# EAGLE design prototype card (EAGLE 9.6.2)
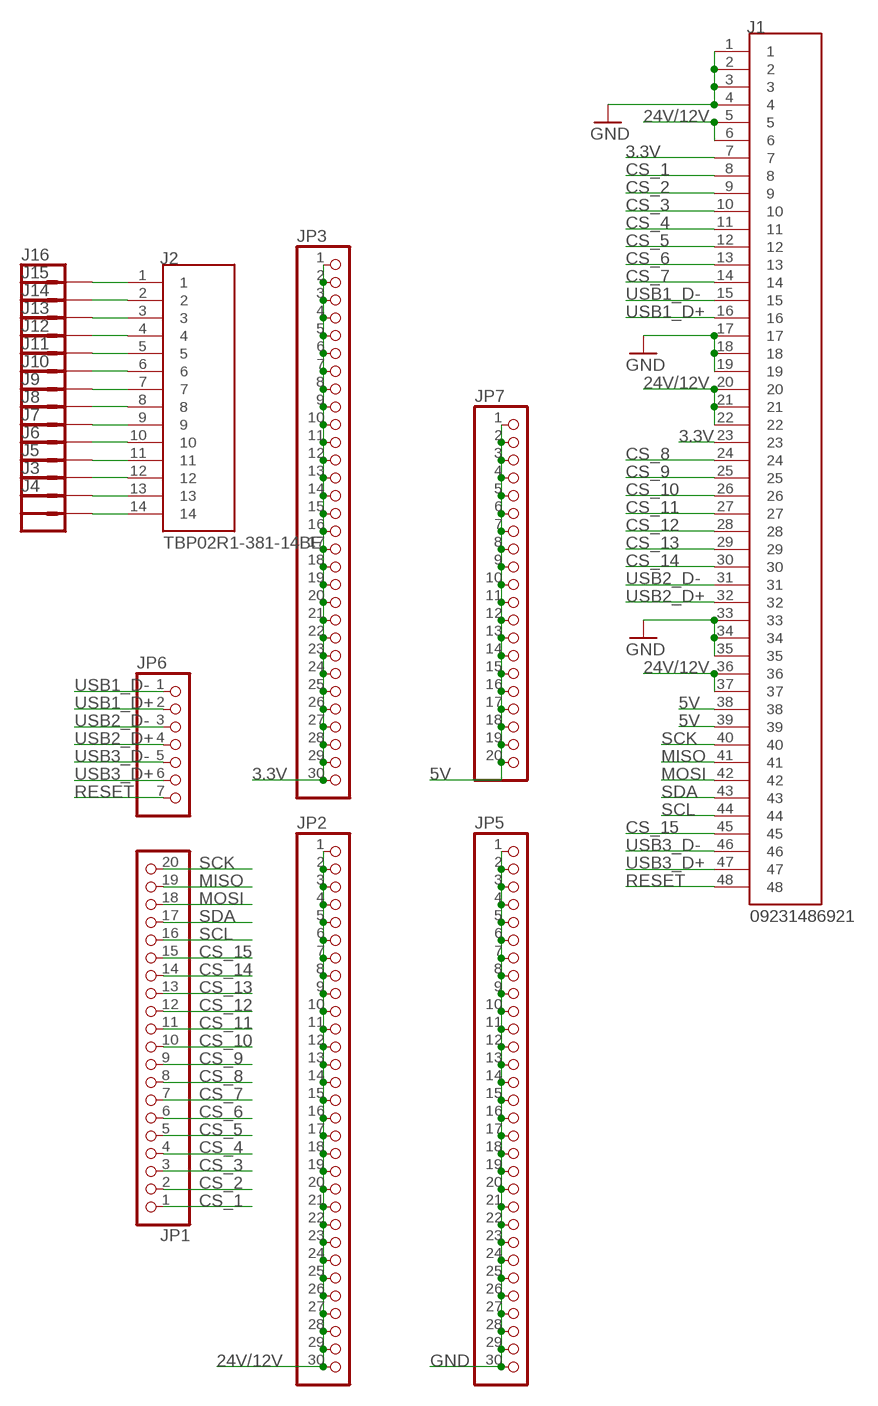
[diagram p0: schematic, sheet 1]

## Parts
J1  09231486921  [HARTING_09231486921]
J2  TBP02R1-381-14BE  [CUI_TBP02R1-381-14BE]
J3  CONN_01PTH_LONGPAD  [1X01_LONGPAD]
J4  CONN_01PTH_LONGPAD  [1X01_LONGPAD]
J5  CONN_01PTH_LONGPAD  [1X01_LONGPAD]
J6  CONN_01PTH_LONGPAD  [1X01_LONGPAD]
J7  CONN_01PTH_LONGPAD  [1X01_LONGPAD]
J8  CONN_01PTH_LONGPAD  [1X01_LONGPAD]
J9  CONN_01PTH_LONGPAD  [1X01_LONGPAD]
J10  CONN_01PTH_LONGPAD  [1X01_LONGPAD]
J11  CONN_01PTH_LONGPAD  [1X01_LONGPAD]
J12  CONN_01PTH_LONGPAD  [1X01_LONGPAD]
J13  CONN_01PTH_LONGPAD  [1X01_LONGPAD]
J14  CONN_01PTH_LONGPAD  [1X01_LONGPAD]
J15  CONN_01PTH_LONGPAD  [1X01_LONGPAD]
J16  CONN_01PTH_LONGPAD  [1X01_LONGPAD]
JP1  PINHD-1X20  [1X20]
JP2  PINHD-1X30  [1X30]
JP3  PINHD-1X30  [1X30]
JP5  PINHD-1X30  [1X30]
JP6  PINHD-1X7  [1X07]
JP7  PINHD-1X20  [1X20]

## Nets
3.3V: J1.7 J1.23 JP3.1 JP3.2 JP3.3 JP3.4 JP3.5 JP3.6 JP3.7 JP3.8 JP3.9 JP3.10 JP3.11 JP3.12 JP3.13 JP3.14 JP3.15 JP3.16 JP3.17 JP3.18 JP3.19 JP3.20 JP3.21 JP3.22 JP3.23 JP3.24 JP3.25 JP3.26 JP3.27 JP3.28 JP3.29 JP3.30
5V: J1.38 J1.39 JP7.1 JP7.2 JP7.3 JP7.4 JP7.5 JP7.6 JP7.7 JP7.8 JP7.9 JP7.10 JP7.11 JP7.12 JP7.13 JP7.14 JP7.15 JP7.16 JP7.17 JP7.18 JP7.19 JP7.20
24V/12V: J1.5 J1.6 J1.20 J1.21 J1.22 J1.36 J1.37 JP2.1 JP2.2 JP2.3 JP2.4 JP2.5 JP2.6 JP2.7 JP2.8 JP2.9 JP2.10 JP2.11 JP2.12 JP2.13 JP2.14 JP2.15 JP2.16 JP2.17 JP2.18 JP2.19 JP2.20 JP2.21 JP2.22 JP2.23 JP2.24 JP2.25 JP2.26 JP2.27 JP2.28 JP2.29 JP2.30
CS_1: J1.8 JP1.1
CS_2: J1.9 JP1.2
CS_3: J1.10 JP1.3
CS_4: J1.11 JP1.4
CS_5: J1.12 JP1.5
CS_6: J1.13 JP1.6
CS_7: J1.14 JP1.7
CS_8: J1.24 JP1.8
CS_9: J1.25 JP1.9
CS_10: J1.26 JP1.10
CS_11: J1.27 JP1.11
CS_12: J1.28 JP1.12
CS_13: J1.29 JP1.13
CS_14: J1.30 JP1.14
CS_15: J1.45 JP1.15
GND: J1.1 J1.2 J1.3 J1.4 J1.17 J1.18 J1.19 J1.33 J1.34 J1.35 JP5.1 JP5.2 JP5.3 JP5.4 JP5.5 JP5.6 JP5.7 JP5.8 JP5.9 JP5.10 JP5.11 JP5.12 JP5.13 JP5.14 JP5.15 JP5.16 JP5.17 JP5.18 JP5.19 JP5.20 JP5.21 JP5.22 JP5.23 JP5.24 JP5.25 JP5.26 JP5.27 JP5.28 JP5.29 JP5.30
MISO: J1.41 JP1.19
MOSI: J1.42 JP1.18
N$1: J2.14 J4.1
N$2: J2.13 J3.1
N$4: J2.12 J5.1
N$5: J2.11 J6.1
N$6: J2.10 J7.1
N$7: J2.9 J8.1
N$8: J2.8 J9.1
N$9: J2.7 J10.1
N$10: J2.6 J11.1
N$11: J2.5 J12.1
N$12: J2.4 J13.1
N$13: J2.3 J14.1
N$14: J2.2 J15.1
N$15: J2.1 J16.1
RESET: J1.48 JP6.7
SCK: J1.40 JP1.20
SCL: J1.44 JP1.16
SDA: J1.43 JP1.17
USB1_D+: J1.16 JP6.2
USB1_D-: J1.15 JP6.1
USB2_D+: J1.32 JP6.4
USB2_D-: J1.31 JP6.3
USB3_D+: J1.47 JP6.6
USB3_D-: J1.46 JP6.5

## Library data of the parts
J1 = din41612_48_pin_board:09231486921: Check prices <https://pricing.snapeda.com/parts/8-1393644-0/TE%20Connectivity/view-part?ref=eda>; AVAILABILITY: In Stock; COMMENT: 09231486921; DESCRIPTION: Conn DIN 41612 M 48 POS 2.54mm Solder RA Thru-Hole Tray; EU_ROHS_COMPLIANCE: Compliant; MF: HARTING; MP: 09231486921; PACKAGE: None; PRICE: 6$; PURCHASE-URL-DIGIKEY: https://www.digikey.ca/en/products/detail/harting/09231486921/3180439
J2 = TBP02R1-381-14BE:TBP02R1-381-14BE: Check prices <https://pricing.snapeda.com/parts/TBP02R1-381-14BE/CUI%20Devices/view-part?ref=eda>; AVAILABILITY: In Stock; CUI_PURCHASE_URL: https://www.cuidevices.com/product/interconnect/connectors/terminal-blocks/tbp02r1-381-series?utm_source=snapeda.com&utm_medium=referral&utm_campaign=snapedaBOM; DESCRIPTION: 2~24 Poles, Pluggable,Receptacle, Horizontal, 3.81 Pitch, Terminal Block Connector; MF: CUI Devices; MP: TBP02R1-381-14BE; PACKAGE: None; PRICE: None; PURCHASE-URL: https://pricing.snapeda.com/search/part/TBP02R1-381-14BE/?ref=eda
J3-J16 = SparkFun-Connectors:CONN_01: Single connection point. Often used as Generic Header-pin footprint for 0.1 inch spaced/style header connections On any of the 0.1 inch spaced packages, you can populate with these: Break Away Headers - Straight <https://www.sparkfun.com/products/116> (PRT-00116) Break Away Male Headers - Right Angle <https://www.sparkfun.com/products/553> (PRT-00553) Female Headers <https://www.sparkfun.com/products/115> (PRT-00115) Break Away Headers - Machine Pin <https://www.sparkfun.com/products/117> (PRT-00117) Break Away Female Headers - Swiss Machine Pin <https://www.sparkfun.com/products/743> (PRT-00743) This device is also useful as a general connection point to wire up your design to another part of your project. Our various solder wires solder well into these plated through hole pads. Hook-Up Wire - Assortment (Stranded, 22 AWG) <https://www.sparkfun.com/products/11375> (PRT-11375) Hook-Up Wire - Assortment (Solid Core, 22 AWG) <https://www.sparkfun.com/products/11367> (PRT-11367) View the entire wire category on our website here <https://www.sparkfun.com/categories/141> Special notes: SMTSO-256-ET is a "flush mount" nut for a 4-40 screw. We mostly use this on specialty testbeds; it is a nice way to connect hardware to your PCB at an adjustable hieght. Also note, the SNAP packages are for using a snappable style connector. We sell a baggie of snaps and they are also used on two LilyPad designs: Snap Assortment - 30 pack (male and female) <https://www.sparkfun.com/products/11347> (DEV-11347) LilyPad Arduino SimpleSnap <https://www.sparkfun.com/products/10941> (DEV-10941) LilyPad SimpleSnap Protoboard <https://www.sparkfun.com/products/10940> (DEV-10940)
JP1 JP7 = pinhead:PINHD-1X20: PIN HEADER
JP2 JP3 JP5 = pinhead:PINHD-1X30: PIN HEADER
JP6 = pinhead:PINHD-1X7: PIN HEADER

## Net classes
1 POWER: clearance 0.508 mm

## Board
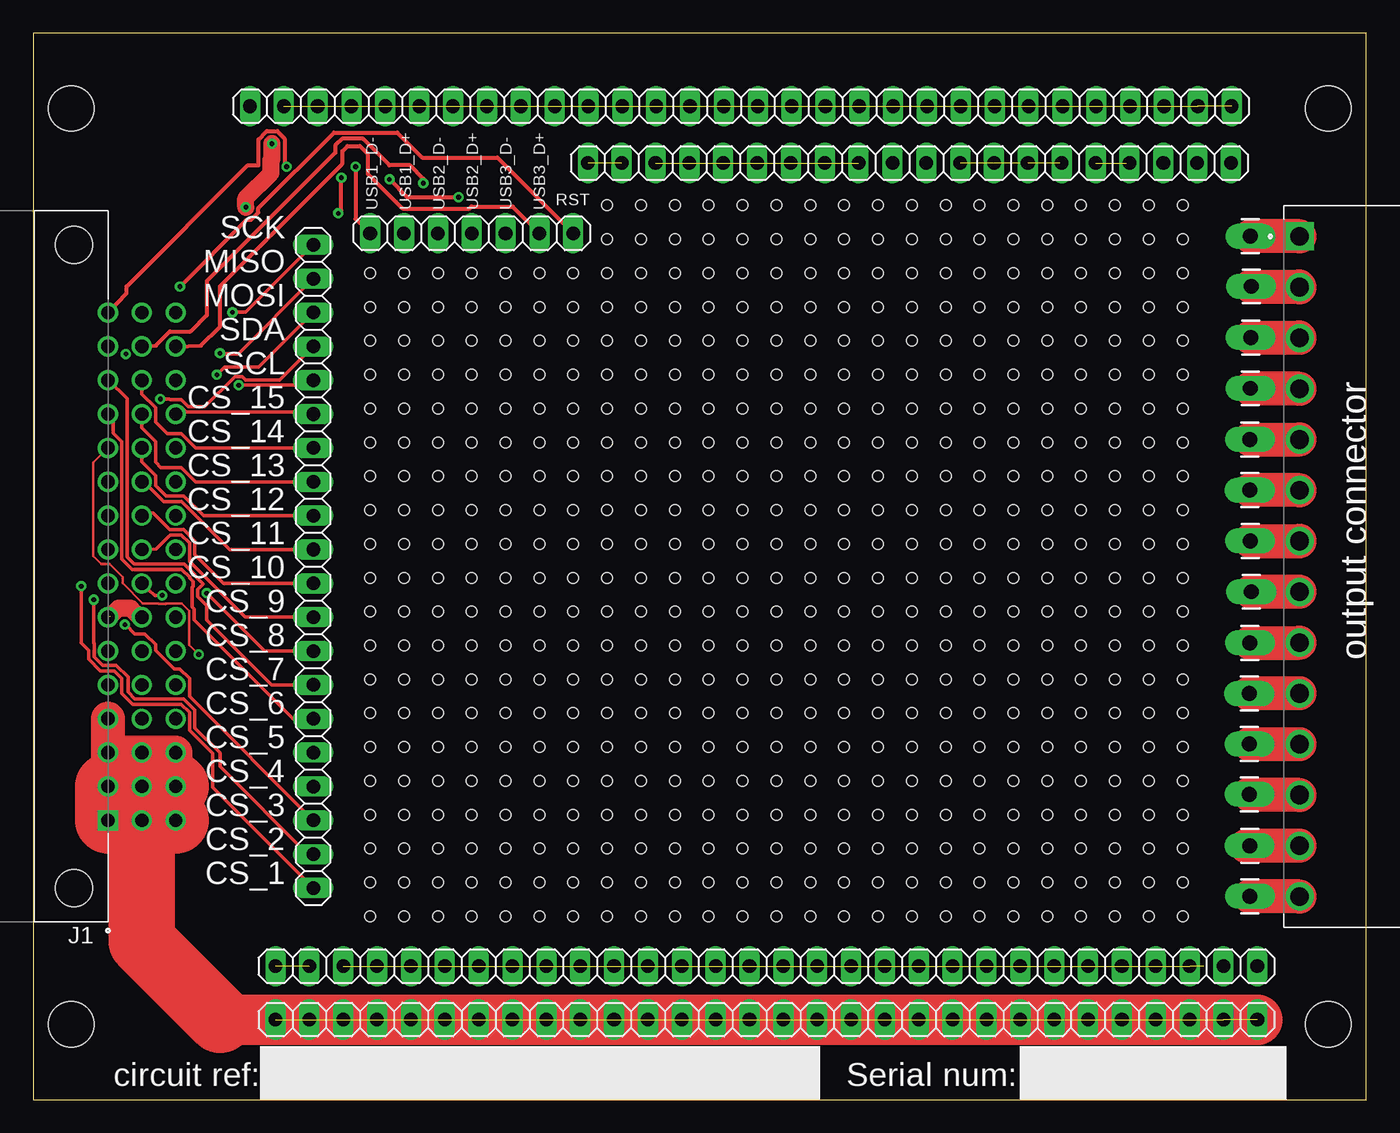
[diagram p1: board, top side]
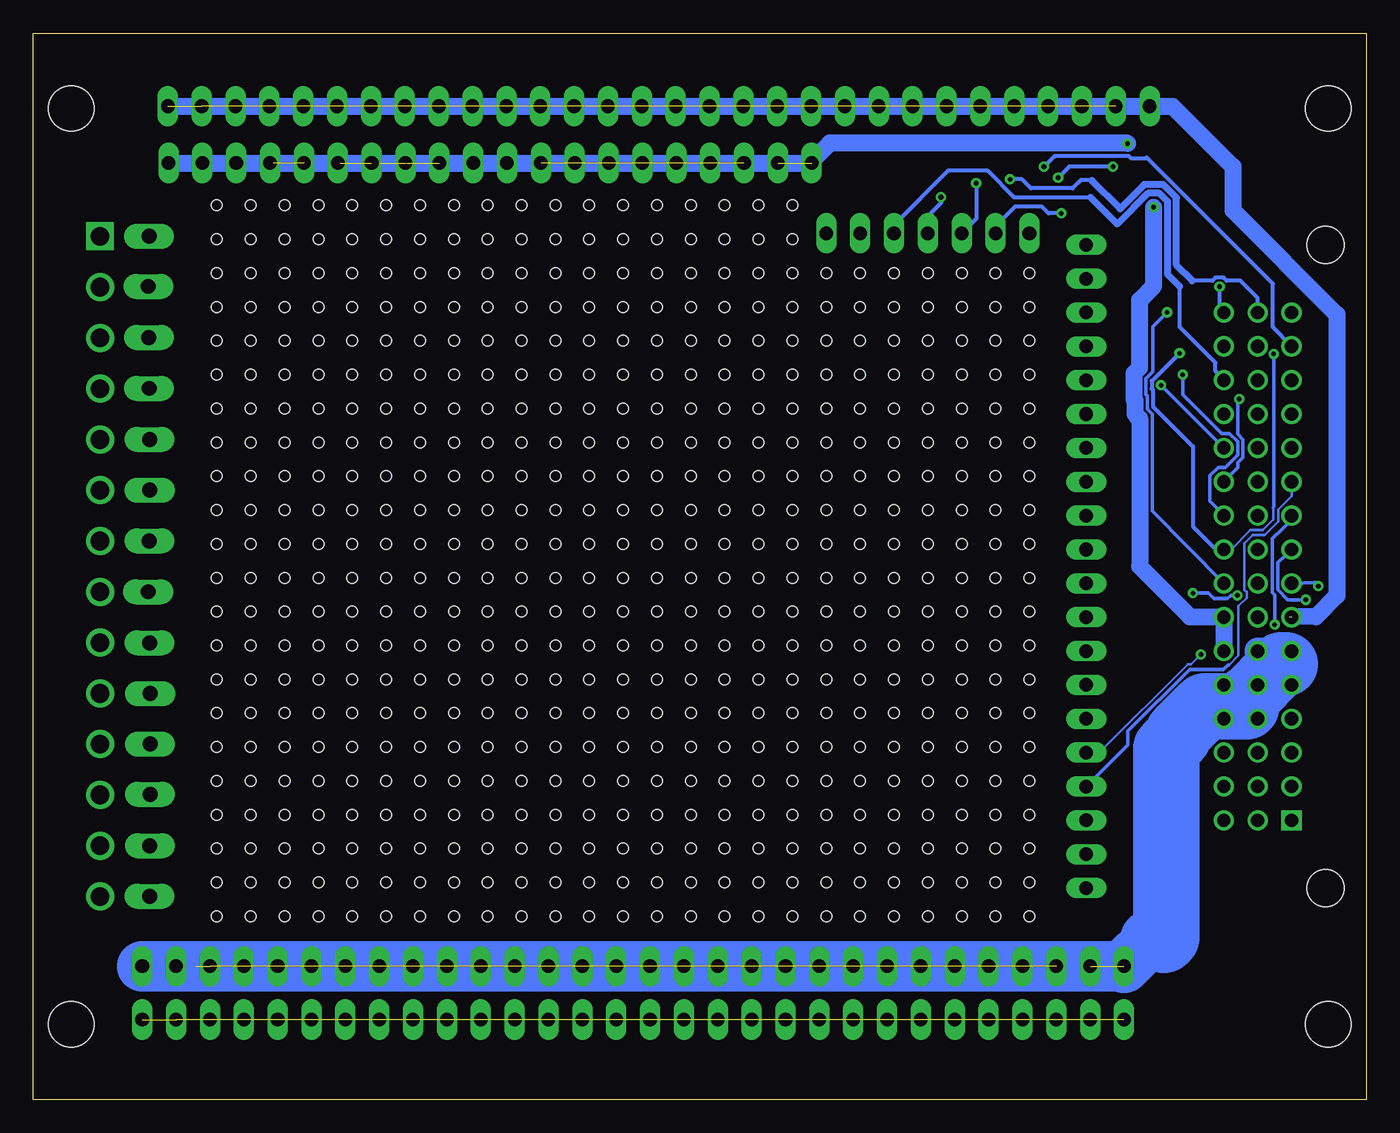
[diagram p2: board, bottom side, seen from below]

Size 100 x 80 mm. Coordinates in mm from the lower left corner, seen from the top.
Outline: 0,0 100,0 100,80 0,80 0,0
Copper layers (1*16): Top 0.035mm / dielectric 1.5mm / Bottom 0.035mm
Design rules "default": minimum track width 6mil, minimum drill 0.35mm, track to track 6mil, track to pad 6mil, pad to pad 6mil, via to via 6mil, smd to smd 6mil, copper to edge 40mil, drill to drill 6mil, minimum pad ring 10mil, minimum via ring 8mil, stop-mask expansion 4mil, vias tented up to drill 0mil, thermal gap 10mil
Holes 3.4 mm at 2.84,5.64 2.84,74.36 97.16,74.36 97.16,5.64
Holes 0.8 mm at 25.27,13.75 27.81,13.75 30.35,13.75 32.89,13.75 35.43,13.75 37.97,13.75 40.51,13.75 43.05,13.75 45.59,13.75 48.13,13.75 50.67,13.75 53.21,13.75 55.75,13.75 58.29,13.75 60.83,13.75 63.37,13.75 65.91,13.75 68.45,13.75 70.99,13.75 73.53,13.75 76.07,13.75 78.61,13.75 81.15,13.75 83.69,13.75 25.27,16.29 27.81,16.29 30.35,16.29 32.89,16.29 35.43,16.29 37.97,16.29 40.51,16.29 43.05,16.29 45.59,16.29 48.13,16.29 50.67,16.29 53.21,16.29 55.75,16.29 58.29,16.29 60.83,16.29 63.37,16.29 65.91,16.29 68.45,16.29 70.99,16.29 73.53,16.29 76.07,16.29 78.61,16.29 81.15,16.29 83.69,16.29 25.27,18.83 27.81,18.83 30.35,18.83 32.89,18.83 35.43,18.83 37.97,18.83 40.51,18.83 43.05,18.83 45.59,18.83 48.13,18.83 50.67,18.83 53.21,18.83 55.75,18.83 58.29,18.83 60.83,18.83 63.37,18.83 65.91,18.83 68.45,18.83 70.99,18.83 73.53,18.83 76.07,18.83 78.61,18.83 81.15,18.83 83.69,18.83 25.27,21.37 27.81,21.37 30.35,21.37 32.89,21.37 35.43,21.37 37.97,21.37 40.51,21.37 43.05,21.37 45.59,21.37 48.13,21.37 50.67,21.37 53.21,21.37 55.75,21.37 58.29,21.37 60.83,21.37 63.37,21.37 65.91,21.37 68.45,21.37 70.99,21.37 73.53,21.37 76.07,21.37 78.61,21.37 81.15,21.37 83.69,21.37 25.27,23.91 27.81,23.91 30.35,23.91 32.89,23.91 35.43,23.91 37.97,23.91 40.51,23.91 43.05,23.91 45.59,23.91 48.13,23.91 50.67,23.91 53.21,23.91 55.75,23.91 58.29,23.91 60.83,23.91 63.37,23.91 65.91,23.91 68.45,23.91 70.99,23.91 73.53,23.91 76.07,23.91 78.61,23.91 81.15,23.91 83.69,23.91 25.27,26.45 27.81,26.45 30.35,26.45 32.89,26.45 35.43,26.45 37.97,26.45 40.51,26.45 43.05,26.45 45.59,26.45 48.13,26.45 50.67,26.45 53.21,26.45 55.75,26.45 58.29,26.45 60.83,26.45 63.37,26.45 65.91,26.45 68.45,26.45 70.99,26.45 73.53,26.45 76.07,26.45 78.61,26.45 81.15,26.45 83.69,26.45 25.27,28.99 27.81,28.99 30.35,28.99 32.89,28.99 35.43,28.99 37.97,28.99 40.51,28.99 43.05,28.99 45.59,28.99 48.13,28.99 50.67,28.99 53.21,28.99 55.75,28.99 58.29,28.99 60.83,28.99 63.37,28.99 65.91,28.99 68.45,28.99 70.99,28.99 73.53,28.99 76.07,28.99 78.61,28.99 81.15,28.99 83.69,28.99 25.27,31.53 27.81,31.53 30.35,31.53 32.89,31.53 35.43,31.53 37.97,31.53 40.51,31.53 43.05,31.53 45.59,31.53 48.13,31.53 50.67,31.53 53.21,31.53 55.75,31.53 58.29,31.53 60.83,31.53 63.37,31.53 65.91,31.53 68.45,31.53 70.99,31.53 73.53,31.53 76.07,31.53 78.61,31.53 81.15,31.53 83.69,31.53 25.27,34.07 27.81,34.07 30.35,34.07 32.89,34.07 35.43,34.07 37.97,34.07 40.51,34.07 43.05,34.07 45.59,34.07 48.13,34.07 50.67,34.07 53.21,34.07 55.75,34.07 58.29,34.07 60.83,34.07 63.37,34.07 65.91,34.07 68.45,34.07 70.99,34.07 73.53,34.07 76.07,34.07 78.61,34.07 81.15,34.07 83.69,34.07 25.27,36.61 27.81,36.61 30.35,36.61 32.89,36.61 35.43,36.61 37.97,36.61 40.51,36.61 43.05,36.61 45.59,36.61 48.13,36.61 50.67,36.61 53.21,36.61 55.75,36.61 58.29,36.61 60.83,36.61 63.37,36.61 65.91,36.61 68.45,36.61 70.99,36.61 73.53,36.61 76.07,36.61 78.61,36.61 81.15,36.61 83.69,36.61 25.27,39.15 27.81,39.15 30.35,39.15 32.89,39.15 35.43,39.15 37.97,39.15 40.51,39.15 43.05,39.15 45.59,39.15 48.13,39.15 50.67,39.15 53.21,39.15 55.75,39.15 58.29,39.15 60.83,39.15 63.37,39.15 65.91,39.15 68.45,39.15 70.99,39.15 73.53,39.15 76.07,39.15 78.61,39.15 81.15,39.15 83.69,39.15 25.27,41.69 27.81,41.69 30.35,41.69 32.89,41.69 35.43,41.69 37.97,41.69 40.51,41.69 43.05,41.69 45.59,41.69 48.13,41.69 50.67,41.69 53.21,41.69 55.75,41.69 58.29,41.69 60.83,41.69 63.37,41.69 65.91,41.69 68.45,41.69 70.99,41.69 73.53,41.69 76.07,41.69 78.61,41.69 81.15,41.69 83.69,41.69 25.27,44.23 27.81,44.23 30.35,44.23 32.89,44.23 35.43,44.23 37.97,44.23 40.51,44.23 43.05,44.23 45.59,44.23 48.13,44.23 50.67,44.23 53.21,44.23 55.75,44.23 58.29,44.23 60.83,44.23 63.37,44.23 65.91,44.23 68.45,44.23 70.99,44.23 73.53,44.23 76.07,44.23 78.61,44.23 81.15,44.23 83.69,44.23 25.27,46.77 27.81,46.77 30.35,46.77 32.89,46.77 35.43,46.77 37.97,46.77 40.51,46.77 43.05,46.77 45.59,46.77 48.13,46.77 50.67,46.77 53.21,46.77 55.75,46.77 58.29,46.77 60.83,46.77 63.37,46.77 65.91,46.77 68.45,46.77 70.99,46.77 73.53,46.77 76.07,46.77 78.61,46.77 81.15,46.77 83.69,46.77 25.27,49.31 27.81,49.31 30.35,49.31 32.89,49.31 35.43,49.31 37.97,49.31 40.51,49.31 43.05,49.31 45.59,49.31 48.13,49.31 50.67,49.31 53.21,49.31 55.75,49.31 58.29,49.31 60.83,49.31 63.37,49.31 65.91,49.31 68.45,49.31 70.99,49.31 73.53,49.31 76.07,49.31 78.61,49.31 81.15,49.31 83.69,49.31 25.27,51.85 27.81,51.85 30.35,51.85 32.89,51.85 35.43,51.85 37.97,51.85 40.51,51.85 43.05,51.85 45.59,51.85 48.13,51.85 50.67,51.85 53.21,51.85 55.75,51.85 58.29,51.85 60.83,51.85 63.37,51.85 65.91,51.85 68.45,51.85 70.99,51.85 73.53,51.85 76.07,51.85 78.61,51.85 81.15,51.85 83.69,51.85 25.27,54.39 27.81,54.39 30.35,54.39 32.89,54.39 35.43,54.39 37.97,54.39 40.51,54.39 43.05,54.39 45.59,54.39 48.13,54.39 50.67,54.39 53.21,54.39 55.75,54.39 58.29,54.39 60.83,54.39 63.37,54.39 65.91,54.39 68.45,54.39 70.99,54.39 73.53,54.39 76.07,54.39 78.61,54.39 81.15,54.39 83.69,54.39 25.27,56.93 27.81,56.93 30.35,56.93 32.89,56.93 35.43,56.93 37.97,56.93 40.51,56.93 43.05,56.93 45.59,56.93 48.13,56.93 50.67,56.93 53.21,56.93 55.75,56.93 58.29,56.93 60.83,56.93 63.37,56.93 65.91,56.93 68.45,56.93 70.99,56.93 73.53,56.93 76.07,56.93 78.61,56.93 81.15,56.93 83.69,56.93 25.27,59.47 27.81,59.47 30.35,59.47 32.89,59.47 35.43,59.47 37.97,59.47 40.51,59.47 43.05,59.47 45.59,59.47 48.13,59.47 50.67,59.47 53.21,59.47 55.75,59.47 58.29,59.47 60.83,59.47 63.37,59.47 65.91,59.47 68.45,59.47 70.99,59.47 73.53,59.47 76.07,59.47 78.61,59.47 81.15,59.47 83.69,59.47 25.27,62.01 27.81,62.01 30.35,62.01 32.89,62.01 35.43,62.01 37.97,62.01 40.51,62.01 43.05,62.01 45.59,62.01 48.13,62.01 50.67,62.01 53.21,62.01 55.75,62.01 58.29,62.01 60.83,62.01 63.37,62.01 65.91,62.01 68.45,62.01 70.99,62.01 73.53,62.01 76.07,62.01 78.61,62.01 81.15,62.01 83.69,62.01 43.05,64.55 45.59,64.55 48.13,64.55 50.67,64.55 53.21,64.55 55.75,64.55 58.29,64.55 60.83,64.55 63.37,64.55 65.91,64.55 68.45,64.55 70.99,64.55 73.53,64.55 76.07,64.55 78.61,64.55 81.15,64.55 83.69,64.55 43.05,67.09 45.59,67.09 48.13,67.09 50.67,67.09 53.21,67.09 55.75,67.09 58.29,67.09 60.83,67.09 63.37,67.09 65.91,67.09 68.45,67.09 70.99,67.09 73.53,67.09 76.07,67.09 78.61,67.09 81.15,67.09 83.69,67.09 86.23,13.75 86.23,16.29 86.23,18.83 86.23,21.37 86.23,23.91 86.23,26.45 86.23,28.99 86.23,31.53 86.23,34.07 86.23,36.61 86.23,39.15 86.23,41.69 86.23,44.23 86.23,46.77 86.23,49.31 86.23,51.85 86.23,54.39 86.23,56.93 86.23,59.47 86.23,62.01 86.23,64.55 86.23,67.09

### Footprints (pad centres in the part's own frame; a part is rotated, then mirrored left to right if it is on the bottom)
HARTING_09231486921 = drill 1 pad 1.35 square: 1 0,0 | drill 1 pad 1.35: 2 -2.54,0; 3 -5.08,0; 4 -7.62,0; 5 -10.16,0; 6 -12.7,0; 7 -15.24,0; 8 -17.78,0; 9 -20.32,0; 10 -22.86,0; 11 -25.4,0; 12 -27.94,0; 13 -30.48,0; 14 -33.02,0; 15 -35.56,0; 16 -38.1,0; 17 0,2.54; 18 -2.54,2.54; 19 -5.08,2.54; 20 -7.62,2.54; 21 -10.16,2.54; 22 -12.7,2.54; 23 -15.24,2.54; 24 -17.78,2.54; 25 -20.32,2.54; 26 -22.86,2.54; 27 -25.4,2.54; 28 -27.94,2.54; 29 -30.48,2.54; 30 -33.02,2.54; 31 -35.56,2.54; 32 -38.1,2.54; 33 0,5.08; 34 -2.54,5.08; 35 -5.08,5.08; 36 -7.62,5.08; 37 -10.16,5.08; 38 -12.7,5.08; 39 -15.24,5.08; 40 -17.78,5.08; 41 -20.32,5.08; 42 -22.86,5.08; 43 -25.4,5.08; 44 -27.94,5.08; 45 -30.48,5.08; 46 -33.02,5.08; 47 -35.56,5.08; 48 -38.1,5.08 | hole 2.8: -43.18,-2.54; 5.08,-2.54
CUI_TBP02R1-381-14BE = drill 1.4 square: 1 0,0 | drill 1.4: 2 3.81,0; 3 7.62,0; 4 11.43,0; 5 15.24,0; 6 19.05,0; 7 22.86,0; 8 26.67,0; 9 30.48,0; 10 34.29,0; 11 38.1,0; 12 41.91,0; 13 45.72,0; 14 49.53,0
1X01_LONGPAD = drill 1.118 pad 1.88 long: 1 0,0
1X20 = drill 1.016 long: 1 -24.13,0; 2 -21.59,0; 3 -19.05,0; 4 -16.51,0; 5 -13.97,0; 6 -11.43,0; 7 -8.89,0; 8 -6.35,0; 9 -3.81,0; 10 -1.27,0; 11 1.27,0; 12 3.81,0; 13 6.35,0; 14 8.89,0; 15 11.43,0; 16 13.97,0; 17 16.51,0; 18 19.05,0; 19 21.59,0; 20 24.13,0
1X30 = drill 1.016 long: 1 -36.83,0; 2 -34.29,0; 3 -31.75,0; 4 -29.21,0; 5 -26.67,0; 6 -24.13,0; 7 -21.59,0; 8 -19.05,0; 9 -16.51,0; 10 -13.97,0; 11 -11.43,0; 12 -8.89,0; 13 -6.35,0; 14 -3.81,0; 15 -1.27,0; 16 1.27,0; 17 3.81,0; 18 6.35,0; 19 8.89,0; 20 11.43,0; 21 13.97,0; 22 16.51,0; 23 19.05,0; 24 21.59,0; 25 24.13,0; 26 26.67,0; 27 29.21,0; 28 31.75,0; 29 34.29,0; 30 36.83,0
1X07 = drill 1.016 long: 1 -7.62,0; 2 -5.08,0; 3 -2.54,0; 4 0,0; 5 2.54,0; 6 5.08,0; 7 7.62,0

### Placement (x,y rotation side)
J1  5.6,20.95 270 top
J2  95,64.77 270 top
J3  91.26,19.04 90 top
J4  91.28,15.25 90 top
J5  91.24,22.9 90 top
J6  91.24,26.67 90 top
J7  91.23,30.46 90 top
J8  91.28,34.26 90 top
J9  91.38,38.1 90 top
J10  91.3,41.92 90 top
J11  91.27,45.73 90 top
J12  91.28,49.53 90 top
J13  91.31,53.36 90 top
J14  91.34,57.17 90 top
J15  91.37,61.01 90 top
J16  91.32,64.77 90 top
JP1  21,40 90 top
JP2  55,10 0 top
JP3  53.08,74.53 0 top
JP5  55,6 0 top
JP6  32.89,65 0 top
JP7  65.73,70.27 0 top

### Tracks (layer width: path | path; a pad name or v marks a point on that pad's centre or on a via)
3.3V  (29 unrouted)
  Top 1.27: J1.23 7.92,36.26 7.31,36.86 6.39,36.86 5.77,36.24
  Bottom 1.27: J1.7 3.76,36.24 2.19,37.81 2.19,58.91 10,66.72 10,70 14.53,74.53 JP3.1 JP3.30
5V  (via drill 0.35)  (11 unrouted)
  Top 1.27: v15.94,66.95 15.94,67.62 17.83,69.51 17.83,70.48 17.91,70.56 v17.91,71.72
  Bottom 1.27: J1.38 J1.39 13.24,36.24 17,40 17,51.1 17.35,51.44 17.35,52.44 17.43,52.52 17.43,54.48 17,54.9 17,60 15.94,61.06 v15.94,66.95 | v17.91,71.72 17.96,71.77 40.23,71.77 41.6,70.4 JP7.1 JP7.9 JP7.10 JP7.11 | JP7.20 JP7.19 JP7.18 JP7.16 JP7.11 | JP7.17 82,70.27 | JP7.15 77,70.27 | JP7.14 74,70.27 | JP7.13 72,70.27 | JP7.12 JP7.11
24V/12V  (27 unrouted)
  Bottom 1.6: J1.6 J1.5 J1.21 | J1.22 J1.21 | J1.21 8.14,30.9 9.01,30.03 | J1.21 J1.37 J1.36 J1.20 J1.21
  Bottom 2: J1.22 J1.6
  Bottom 3.8: 87.83,10 JP2.1 | JP2.28 JP2.29 JP2.30
  Bottom 4: JP2.1 16.17,12
  Bottom 4.6: 16.17,12 15.17,12
  Bottom 4.8: 6,32.66 6.38,32.66 9.01,30.03
  Bottom 5: 15.17,12 15,12.17 15,26.33 14.09,27.25 14.09,27.49 12.09,29.49 9.01,29.49 9.01,30.03
CS_1  (via drill 0.35)
  Top 0.254: JP1.1 13.46,23.41 13.46,25.97 11.71,27.71 11.71,29.05 11.11,29.65 7.44,29.65 6.63,30.46 6.63,31.59 6.05,32.17 5.03,32.17 4.16,33.04 4.16,33.68 3.59,34.25 v3.59,38.52
  Bottom 0.254: v3.59,38.52 3.85,38.78 J1.8
CS_2  (via drill 0.35)
  Top 0.254: v4.53,37.5 4.53,34.27 4.57,34.23 4.57,33.21 5.19,32.59 6.21,32.59 7.11,31.69 7.11,30.57 7.62,30.06 11.28,30.06 12.12,29.22 12.12,27.88 14,26 14,25 20.59,18.41 JP1.2
  Bottom 0.254: v4.53,37.5 5.87,37.5 6.63,38.26 6.63,40.29 J1.9
CS_3  (via drill 0.35)
  Top 0.254: JP1.3 11.71,30.24 11.71,31.59 10.98,32.32 10.55,32.32 9.17,33.7 9.17,34.13 8.36,34.95 7.61,34.95 6.92,35.63 v6.87,35.63
  Bottom 0.254: v6.87,35.63 6.87,37.87 7.04,38.04 7.04,42.09 5.6,43.48 J1.10
CS_4
  Bottom 0.2: 10.35,32.62 10.28,32.62 9.58,33.32 9.58,37.03 8.97,37.64 8.97,38.07 9.15,38.25 9.15,41.74 8.52,42.37 7.62,42.37 6.61,43.38 6.61,44.28 5.6,45.28 J1.11
  Bottom 0.254: 10.35,32.62 10.7,32.27 13.24,32.27 17.87,27.64 17.87,26.62 JP1.4
CS_5  (via drill 0.35)
  Top 0.2: v12.4,33.4 11.69,34.11 11.69,36.66 11.14,37.2 9.94,37.2 9.93,37.2 9.41,37.2 9.38,37.23 8.23,37.23 | J1.12 4.48,47.8 4.48,40.79 5.1,40.16 5.73,40.16 6.7,39.2 6.7,38.74 8.21,37.23 8.23,37.23 | 8.25,37.2 8.23,37.23
  Bottom 0.2: v12.4,33.4 13.15,32.65 13.4,32.65 20.02,26.03 JP1.5
CS_6
  Top 0.254: JP1.6 19.5,28.57 12.07,36 12.07,36.81 11.94,36.94 11.94,38.44 12,38.51 12,38.85 11.71,39.14 11.71,39.21 11.14,39.78 7.4,39.78 6.63,40.55 6.63,49.37 6,50 6,51.08 J1.13
CS_7
  Top 0.254: JP1.7 17.89,31.11 13,36 13,37.07 12.34,37.73 12.34,38.27 12.75,38.68 12.12,39.3 12.12,39.38 11.31,40.19 7.57,40.19 7.04,40.72 7.04,52.58 J1.14
CS_8  (via drill 0.35)
  Top 0.254: JP1.8 17.35,33.65 v13,38 | v9.67,37.83 9.09,37.83 J1.24
  Bottom 0.254: v13,38 11.84,38 11.44,37.6 10.4,37.6 10.17,37.83 v9.67,37.83
CS_9
  Top 0.254: JP1.9 15.88,36.19 11.71,40.36 11.71,41.75 11.11,42.35 10.25,42.35 9.22,41.32 J1.25
CS_10
  Top 0.254: JP1.10 14.27,38.73 12.12,40.88 12.12,41.92 11.28,42.76 10.24,42.76 9,44 8.28,44 J1.26
CS_11
  Top 0.254: JP1.11 14.73,41.27 11.13,44.87 9.79,44.87 8.29,46.37 J1.27
CS_12
  Top 0.254: JP1.12 12.77,43.81 11.29,45.29 9.95,45.29 9.17,46.06 9.17,46.83 8.14,47.86 J1.28
CS_13
  Top 0.254: JP1.13 12.19,46.35 11.11,47.43 9.57,47.43 9.17,47.83 9.17,49.37 8.14,50.4 J1.29
CS_14
  Top 0.254: JP1.14 12.19,48.89 11.11,49.97 10.03,49.97 9.17,50.83 9.17,51.91 8.14,52.94 J1.30
CS_15
  Top 0.254: JP1.15 20.84,51.59 11.45,51.59 11.12,51.92 J1.45
GND  (29 unrouted)
  Top 2.54: J1.34 J1.35 J1.3 | J1.18 J1.19 | J1.2 J1.3 | J1.3 J1.4
  Top 3.8: JP5.30 14,6
  Top 5: 14,6 8.14,11.86 J1.17 | J1.33 J1.17 | J1.17 J1.1 J1.2 7.46,23.54 8,23 | J1.34 J1.18 7,22.4 7,22 8,21 J1.17
MISO  (via drill 0.35)
  Top 0.254: JP1.19 15.35,55.94
  Top 0.305: 15.35,55.94 14.06,55.94 v14,56
  Bottom 0.2: 6.99,44.43 6.99,43.5 7.76,42.73 8.69,42.73 10.1,41.32
  Bottom 0.254: v6.94,55.94 6.94,44.48 6.99,44.43 | 10.1,41.32 J1.41
  Bottom 0.305: v14,56 16.08,53.92 16.08,53.32 16,53.23 16,52 13,49 13,43 11.32,41.32 J1.41
MOSI  (via drill 0.35)
  Top 0.254: JP1.18 16.91,54.96 14.35,54.96 v13.77,54.38
  Bottom 0.254: v13.77,54.38 13.77,52.91 10.84,49.97 10.25,49.97 9.65,49.37 9.65,48.35 10.57,47.43 11.11,47.43 11.71,46.83 11.71,44.89 J1.42
N$1
  Top 2.54: J2.14 91.3,15.23 J4.1
N$2
  Top 2.54: J2.13 91.05,19.05 91,19 91.22,19 J3.1
N$4
  Top 2.54: J2.12 91.28,22.86 J5.1
N$5
  Top 2.54: J6.1 J2.11
N$6
  Top 2.54: J2.10 91.25,30.48 J7.1
N$7
  Top 2.54: J8.1 94.97,34.26 J2.9
N$8
  Top 2.54: J2.8 J9.1
N$9
  Top 2.54: J10.1 94.98,41.92 J2.7
N$10
  Top 2.54: J2.6 91.28,45.72 J11.1
N$11
  Top 2.54: J12.1 J2.5
N$12
  Top 2.54: J2.4 91.33,53.34 J13.1
N$13
  Top 2.54: J14.1 94.97,57.17 J2.3
N$14
  Top 2.54: J15.1 94.94,61.01 J2.2
N$15
  Top 2.54: J2.1 J16.1
RESET  (via drill 0.35)
  Top 0.305: JP6.7 34.83,70.68 29.17,70.68 27.3,72.55 22.55,72.55 16.88,66.88 16.88,66.56 16.33,66.01 16.01,66.01 v11,61
  Bottom 0.305: J1.48 11,59.42 v11,61
SCK  (via drill 0.35)
  Top 0.254: JP1.20 18.93,62.06 15.94,59.06 v14.94,59.06
  Bottom 0.254: J1.40 16.06,44.16 16.06,51.45 16.43,51.82 16.43,52.82 16.52,52.9 16.52,54.1 16,54.61 16,58 v14.94,59.06
SCL  (via drill 0.35)
  Top 0.254: JP1.16 20.04,53.97 19.66,53.59 15.76,53.59 15.76,53.6 v15.4,53.6
  Bottom 0.254: v15.4,53.6 10.74,48.94 J1.44
SDA  (via drill 0.35)
  Top 0.254: JP1.17 18.49,54 15.93,54 15.67,54.26 15.13,54.26 12.87,52 11.62,52 11.11,52.51 10.25,52.51 10.2,52.56 v9.53,52.56
  Bottom 0.254: v9.53,52.56 9.65,52.45 9.65,49.94 9.24,49.54 9.24,48.19 9.65,47.78 9.65,47.43 J1.43
USB1_D+  (via drill 0.35)
  Top 0.305: J1.16 7,60.5 7,61 16.09,70.09 16.89,70.09 16.89,72.03 17.52,72.66 18.3,72.66 18.85,72.11 18.85,70.15 v19,70 | v23.11,69.17 23.11,66.73 v22.88,66.5
  Bottom 0.305: v19,70 22.28,70 v23.11,69.17 | JP6.2 27.81,65.54 26.35,67 24.34,67 23.84,66.5 v22.88,66.5
USB1_D-  (via drill 0.35)
  Top 0.305: JP6.1 24.18,66.09 v24.18,69.99
  Bottom 0.305: J1.15 7,57.96 7,61.21 16.4,70.6 | 16.4,70.6 16.48,70.69 | 16.4,70.6 17.6,70.6 17.78,70.78 23.39,70.78 v24.18,69.99
USB2_D+  (via drill 0.35)
  Top 0.305: v26.72,69.05 28.06,67.71 v31.9,67.71
  Bottom 0.305: J1.32 8.14,60.14 9.44,61.44 10.47,61.44 10.72,61.68 11.28,61.68 11.53,61.44 13.06,61.44 | 20.58,68.96 20.58,68.99 21.4,68.99 22.03,68.37 25.15,68.37 25.84,69.05 v26.72,69.05 | v31.9,67.71 31.9,67.27 32.89,66.28 JP6.4
  Bottom 0.508: 13.06,61.44 14.24,62.62 14.24,67.66 15.23,68.65 16.64,68.65 18.46,66.84 20.58,68.96
USB2_D-  (via drill 0.35)
  Top 0.305: J1.31 9.18,56.56 10.24,57.62 11.8,57.62 13.02,58.84 13.02,61.41 22.65,71.04 22.65,71.59 23.15,72.09 24.74,72.09 26.73,70.1 28.26,70.1 29.26,69.11 v29.26,68.76
  Bottom 0.305: v29.26,68.76 29.26,66.09 JP6.3
USB3_D+
  Top 0.305: J1.47 12.56,56.56 14,58 14,61.03 23.2,70.22 23.2,71.16 23.58,71.55 24.5,71.55 25.09,70.96 25.09,69.45 27.69,66.85 32.71,66.85 32.87,67 35.97,67 JP6.6
USB3_D-
  Bottom 0.305: J1.46 11.32,54.66 11.32,55.28 14,57.97 14,61 | JP6.5 35.43,65.62 31.37,69.68 28.39,69.68 26.38,67.67 20.67,67.67
  Bottom 0.508: 14,61 14.9,61.9 14.9,67.38 15.51,67.99 16.37,67.99 18.68,65.68 20.67,67.67

### Text on the board
tNames: RST | USB1_D- / / USB1_D+ / / USB2_D- / / USB2_D+ / / USB3_D- / / USB3_D+ | output connector | SCK / MISO / MOSI / SDA / SCL / CS_15 / CS_14 / CS_13 / CS_12 / CS_11 / CS_10 / CS_9 / CS_8 / CS_7 / CS_6 / CS_5 / CS_4 / CS_3 / CS_2 / CS_1 | circuit ref: | Serial num:
tStop: PolyVent prototyping board V1.2 - Public Invention -Liscence: CERN OHL V2.0 | 3.3V | 5V | 24V/12V / / GND